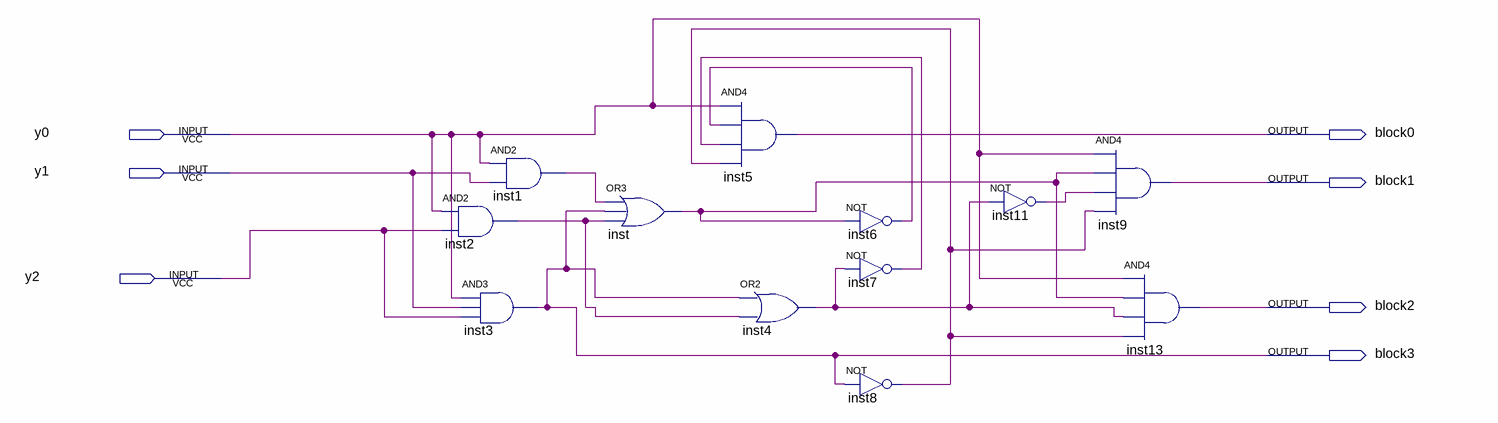
[diagram p0: schematic sheet]
// Quartus schematic try1.bdf as structural Verilog: 12 symbols, 7 pins
module try1 (
  input  y0,
  input  y1,
  input  y2,
  output block0,
  output block1,
  output block2,
  output block3
);

  wire inst1_out, inst2_out, inst4_out, inst6_out, inst7_out, inst8_out, inst11_out, inst_out;

  and inst2 (inst2_out, y0, y2);
  and inst1 (inst1_out, y0, y1);
  and inst3 (block3, y0, y1, y2);
  or inst (inst_out, inst1_out, block3, inst2_out);
  and inst5 (block0, y0, inst6_out, inst7_out, inst8_out);
  or inst4 (inst4_out, block3, inst2_out);
  not inst6 (inst6_out, inst_out);
  not inst7 (inst7_out, inst4_out);
  not inst8 (inst8_out, block3);
  not inst11 (inst11_out, inst4_out);
  and inst9 (block1, y0, inst_out, inst11_out, inst8_out);
  and inst13 (block2, y0, inst_out, inst4_out, inst8_out);
endmodule
